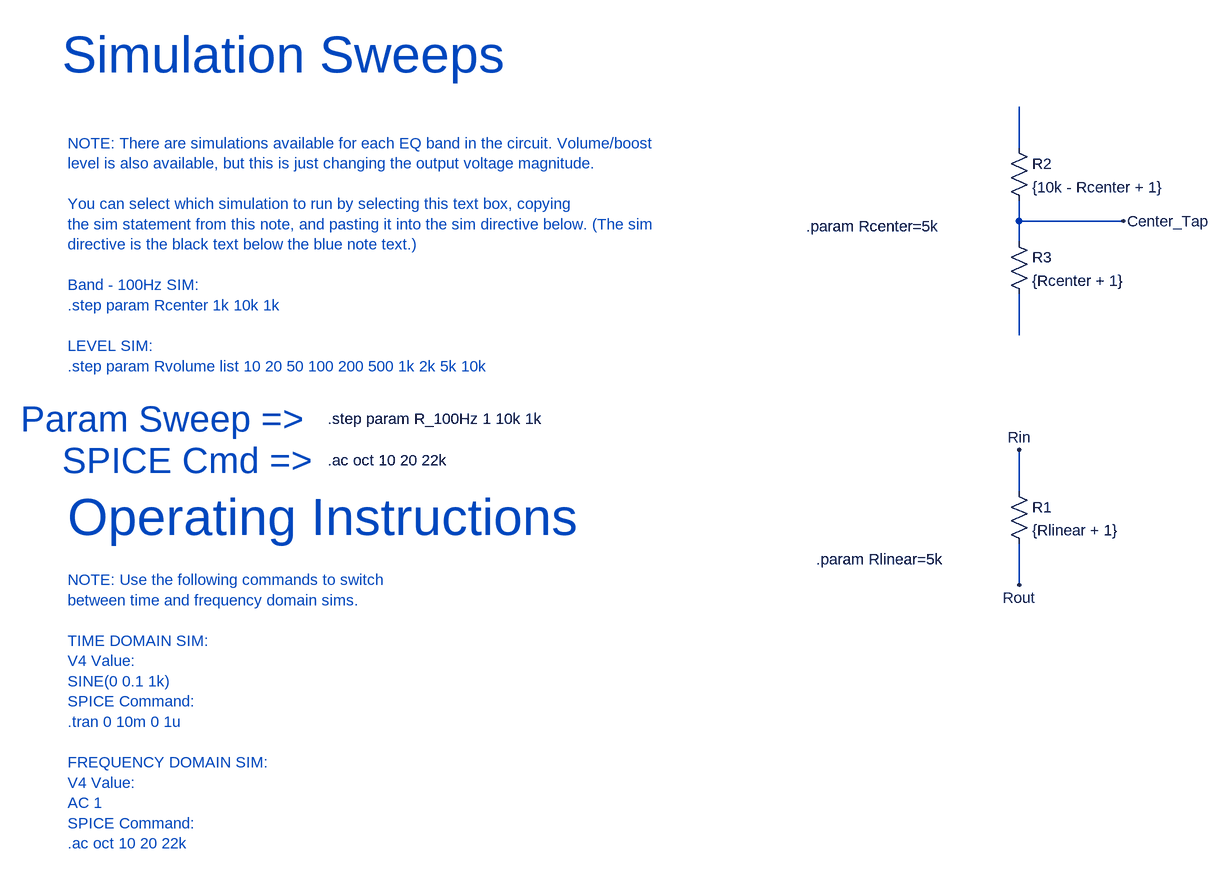
[diagram p0: schematic ltspice-template.asc]
ltspice-template.asc, the LTspice schematic file:
Version 4
SHEET 1 3852 5064
WIRE 176 1232 176 1168
WIRE 176 1344 176 1312
WIRE 336 1344 176 1344
WIRE 176 1376 176 1344
WIRE 176 1520 176 1456
WIRE 176 1760 176 1696
WIRE 176 1904 176 1840
FLAG 176 1904 Rout
FLAG 176 1696 Rin
FLAG 336 1344 Center_Tap
SYMBOL res 160 1744 R0
SYMATTR InstName R1
SYMATTR Value {Rlinear + 1}
SYMBOL res 160 1216 R0
SYMATTR InstName R2
SYMATTR Value {10k - Rcenter + 1}
SYMBOL res 160 1360 R0
SYMATTR InstName R3
SYMATTR Value {Rcenter + 1}
TEXT -1288 1224 Left 2 ;NOTE: There are simulations available for each EQ band in the circuit. Volume/boost \nlevel is also available, but this is just changing the output voltage magnitude.\n \nYou can select which simulation to run by selecting this text box, copying \nthe sim statement from this note, and pasting it into the sim directive below. (The sim \ndirective is the black text below the blue note text.)\n \nBand - 100Hz SIM:\n.step param Rcenter 1k 10k 1k\n \nLEVEL SIM:\n.step param Rvolume list 10 20 50 100 200 500 1k 2k 5k 10k
TEXT -152 1352 Left 2 !.param Rcenter=5k
TEXT -1288 1896 Left 2 ;NOTE: Use the following commands to switch \nbetween time and frequency domain sims.\n \nTIME DOMAIN SIM:\nV4 Value: \nSINE(0 0.1 1k)\nSPICE Command: \n.tran 0 10m 0 1u\n \nFREQUENCY DOMAIN SIM:\nV4 Value: \nAC 1\nSPICE Command:\n.ac oct 10 20 22k
TEXT -888 1648 Left 2 !.step param R_100Hz 1 10k 1k
TEXT -888 1712 Left 2 !.ac oct 10 20 22k
TEXT -1296 1712 Left 5 ;SPICE Cmd =>
TEXT -1360 1648 Left 5 ;Param Sweep =>
TEXT -1296 1088 Left 6 ;Simulation Sweeps
TEXT -1288 1800 Left 6 ;Operating Instructions
TEXT -136 1864 Left 2 !.param Rlinear=5k

The netlist it stands for:
* ltspice-template.asc
R1 Rin Rout {Rlinear + 1}
R2 N001 Center_Tap {10k - Rcenter + 1}
R3 Center_Tap N002 {Rcenter + 1}
* NOTE: There are simulations available for each EQ band in the circuit. Volume/boost
* level is also available, but this is just changing the output voltage magnitude.
* You can select which simulation to run by selecting this text box, copying
* the sim statement from this note, and pasting it into the sim directive below. (The sim
* directive is the black text below the blue note text.)
* Band - 100Hz SIM:
* .step param Rcenter 1k 10k 1k
* LEVEL SIM:
* .step param Rvolume list 10 20 50 100 200 500 1k 2k 5k 10k
.param Rcenter=5k
* NOTE: Use the following commands to switch
* between time and frequency domain sims.
* TIME DOMAIN SIM:
* V4 Value:
* SINE(0 0.1 1k)
* SPICE Command:
* .tran 0 10m 0 1u
* FREQUENCY DOMAIN SIM:
* V4 Value:
* AC 1
* SPICE Command:
* .ac oct 10 20 22k
.step param R_100Hz 1 10k 1k
.ac oct 10 20 22k
* SPICE Cmd =>
* Param Sweep =>
* Simulation Sweeps
* Operating Instructions
.param Rlinear=5k
.backanno
.end